# Altium schematic sheet Switch.SchDoc
size A; SheetNumber: 3; SheetTotal: 3
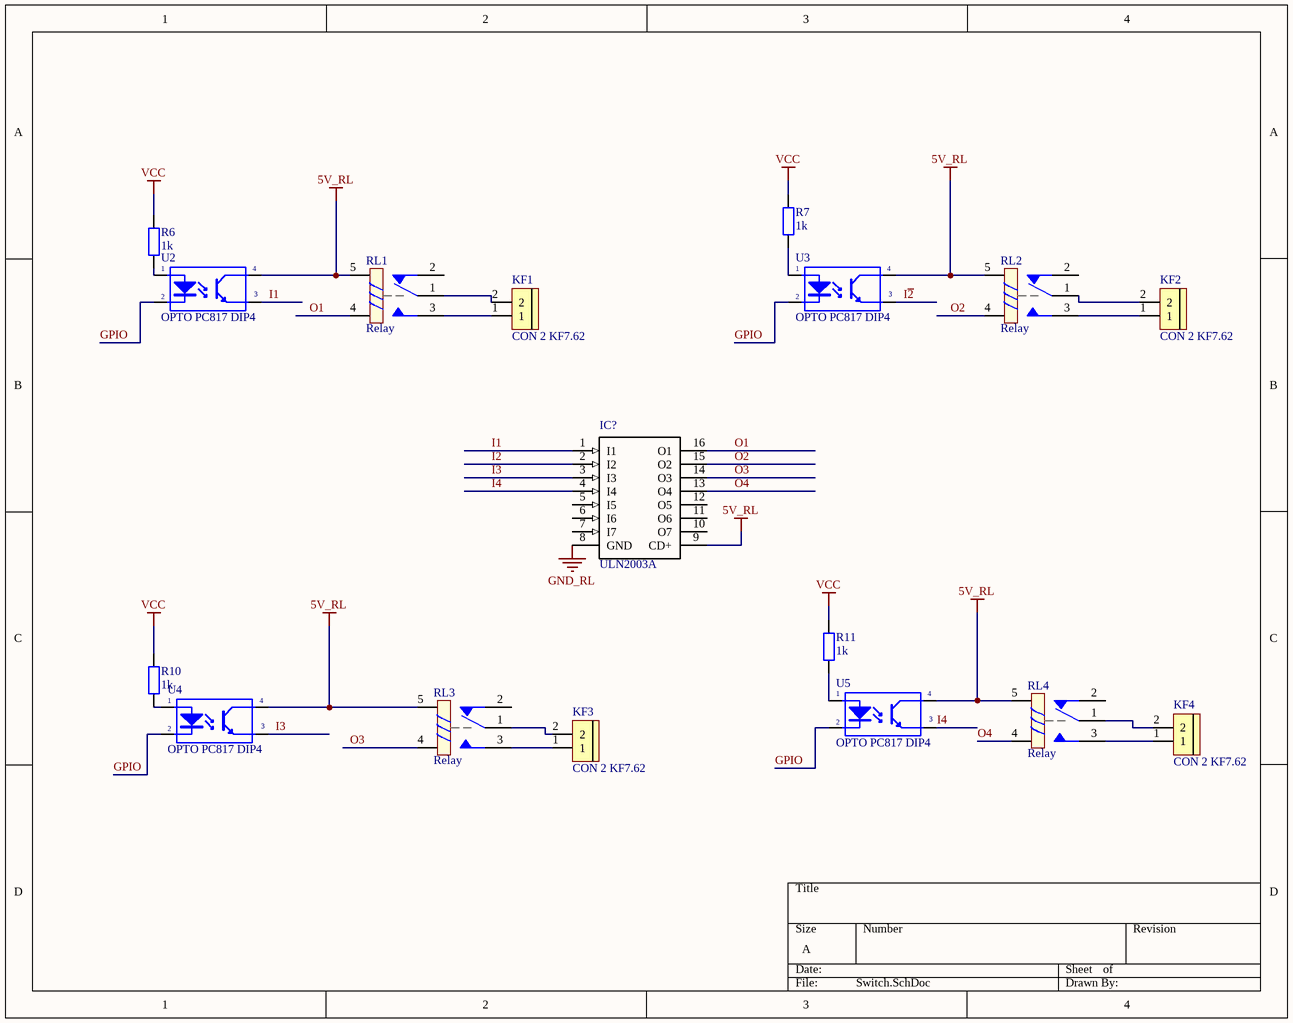
[diagram p0: Switch.SchDoc]

## Parts
IC?  ULN2003A  [*DIL16]
KF1  CON 2 KF7.62  [CON 2 KF7.62]
KF2  CON 2 KF7.62  [CON 2 KF7.62]
KF3  CON 2 KF7.62  [CON 2 KF7.62]
KF4  CON 2 KF7.62  [CON 2 KF7.62]
R6  1k  [tro vach 1/2w]
R7  1k  [tro vach 1/2w]
R10  1k  [tro vach 1/2w]
R11  1k  [tro vach 1/2w]
RL1  Relay  [Relay 5 Chan SRD]
RL2  Relay  [Relay 5 Chan SRD]
RL3  Relay  [Relay 5 Chan SRD]
RL4  Relay  [Relay 5 Chan SRD]
U2  OPTO PC817 DIP4  [DIP4]
U3  OPTO PC817 DIP4  [DIP4]
U4  OPTO PC817 DIP4  [DIP4]
U5  OPTO PC817 DIP4  [DIP4]

## Nets
5V_RL: IC?.9(CD+) RL1.5 RL2.5 RL3.5 RL4.5 U2.4(C) U3.4(C) U4.4(C) U5.4(C)
GND_RL: IC?.8(GND)
VCC: R6.2 R7.2 R10.2 R11.2
GPIO: U2.2(K) U3.2(K) U4.2(K) U5.2(K)
I1: IC?.1(I1) U2.3(E)
I~{2}: IC?.2(I2) U3.3(E)
I3: IC?.3(I3) U4.3(E)
I4: IC?.4(I4) U5.3(E)
O1: IC?.16(O1) RL1.4
O2: IC?.15(O2) RL2.4
O3: IC?.14(O3) RL3.4
O4: IC?.13(O4) RL4.4
NetKF1_1: KF1.1 RL1.3
NetKF1_2: KF1.2 RL1.1
NetKF2_1: KF2.1 RL2.3
NetKF2_2: KF2.2 RL2.1
NetKF3_1: KF3.1 RL3.3
NetKF3_2: KF3.2 RL3.1
NetKF4_1: KF4.1 RL4.3
NetKF4_2: KF4.2 RL4.1
NetR6_1: R6.1 U2.1(A)
NetR7_1: R7.1 U3.1(A)
NetR10_1: R10.1 U4.1(A)
NetR11_1: R11.1 U5.1(A)

Not connected (* = marked no-connect by the designer): IC? 5(I5) 6(I6) 7(I7) 10(O7) 11(O6) 12(O5); RL1 2; RL2 2; RL3 2; RL4 2

## Library data of the parts
IC? = ULN2003A: / DARLINGTON ARRAY 7NPN, 2003, DIP16; Transistor Polarity:NPN; Collector Emitter Voltage V(br)ceo:50V; DC Collector Current:500mA; DC Current Gain hFE:1000; Operating Temperature Range:-20Â°C to +85Â°C; Transistor Case Style:DIP; No. of Pins:16; SVHC:No SVHC (20-Jun-2011); Base Number:2003; Current Ic Continuous a Max:500mA; Device Marking:ULN2003A; IC Generic Number:2003; Input Type:TTL, CMOS 5V; Input Voltage Max:5V; Logic Function Number:2003; Module Configuration:Seven; No. of Channels:7; No. of Transistors:7; Operating Temperature Max:85Â°C; Operating Temperature Min:-20Â°C; Output Current Max:500mA; Output Type:Open Collector; Output Voltage Max:50V; Package / Case:DIP; Termination Type:Through Hole; Transistor Type:Power Darlington /; MF: STMicroelectronics; SnapEDA_Link: https://www.snapeda.com/parts/ULN2003A/STMicroelectronics/view-part/?ref=snap; Package: DIP-16 Sprague; MP: ULN2003A; Check_prices: https://www.snapeda.com/parts/ULN2003A/STMicroelectronics/view-part/?ref=eda; Value: *
KF1-KF4 = CON 2 KF7.62: Cắm; Ma_Hang: MH002053; Ten_Linh_Kien: CON 2 KF7.62-2P 7.62MM (Đen Thẳng); Chung_Loai: Cắm; Ghi_Chu: *; Kieu_Chan: *; Don_Vi: Con
R6 R7 R10 R11 = Tro Vach 1/2W 5% 1M: Cắm; Don_Vi: Con; So_Chan: 2; Ten_Linh_Kien: Trở 5% 1/2w 1M; Ma_Hang: MH007242; Chung_Loai: Cắm; Kieu_Chan: *
RL1-RL4 = Relay 5 Chan SRD: Relay 5 Chan; Ma_Hang: MH009374; Ten: Relay 5V10A SRD-05VDC-SL-C Chính Hãng
U2-U5 = OPTO PC817 DIP4: Single Opto; Value: PC817